# Altium schematic sheet УПП.SchDoc
size 420 x 297 mm; PageSetup: Record=PageOptions|CenterHorizontal=False|CenterVertical=False|PrintScale=0.95|XCorrection=0.00|YCorrection=0.00|PrintKind=1|BorderSize=5000000|LeftOffset=0|BottomOffset=0|Orientation=1|PaperLength=1000|PaperWidth=1000|Scale=100|PaperSource=15|PrintQuality=600|MediaType=1|DitherType=10|PaperKind=A4|PrintScaleMode=1; Scale: {Масш.}; Title1str: {Наименование}; Title2str: {Наименование}; ProcessInspection: {Т.контр.}; Mass: {Масса}; NormInspection: {Н.контр.}; EngineerName: {Инженер}; Letter1Column: {}; Letter2Column: {}; Letter3Column: {}; DocumentType: {Документ}; DocumentType1str: {Документ}; DocumentType2str: {Документ}; DocumentNumber1: {Обозначение 1}
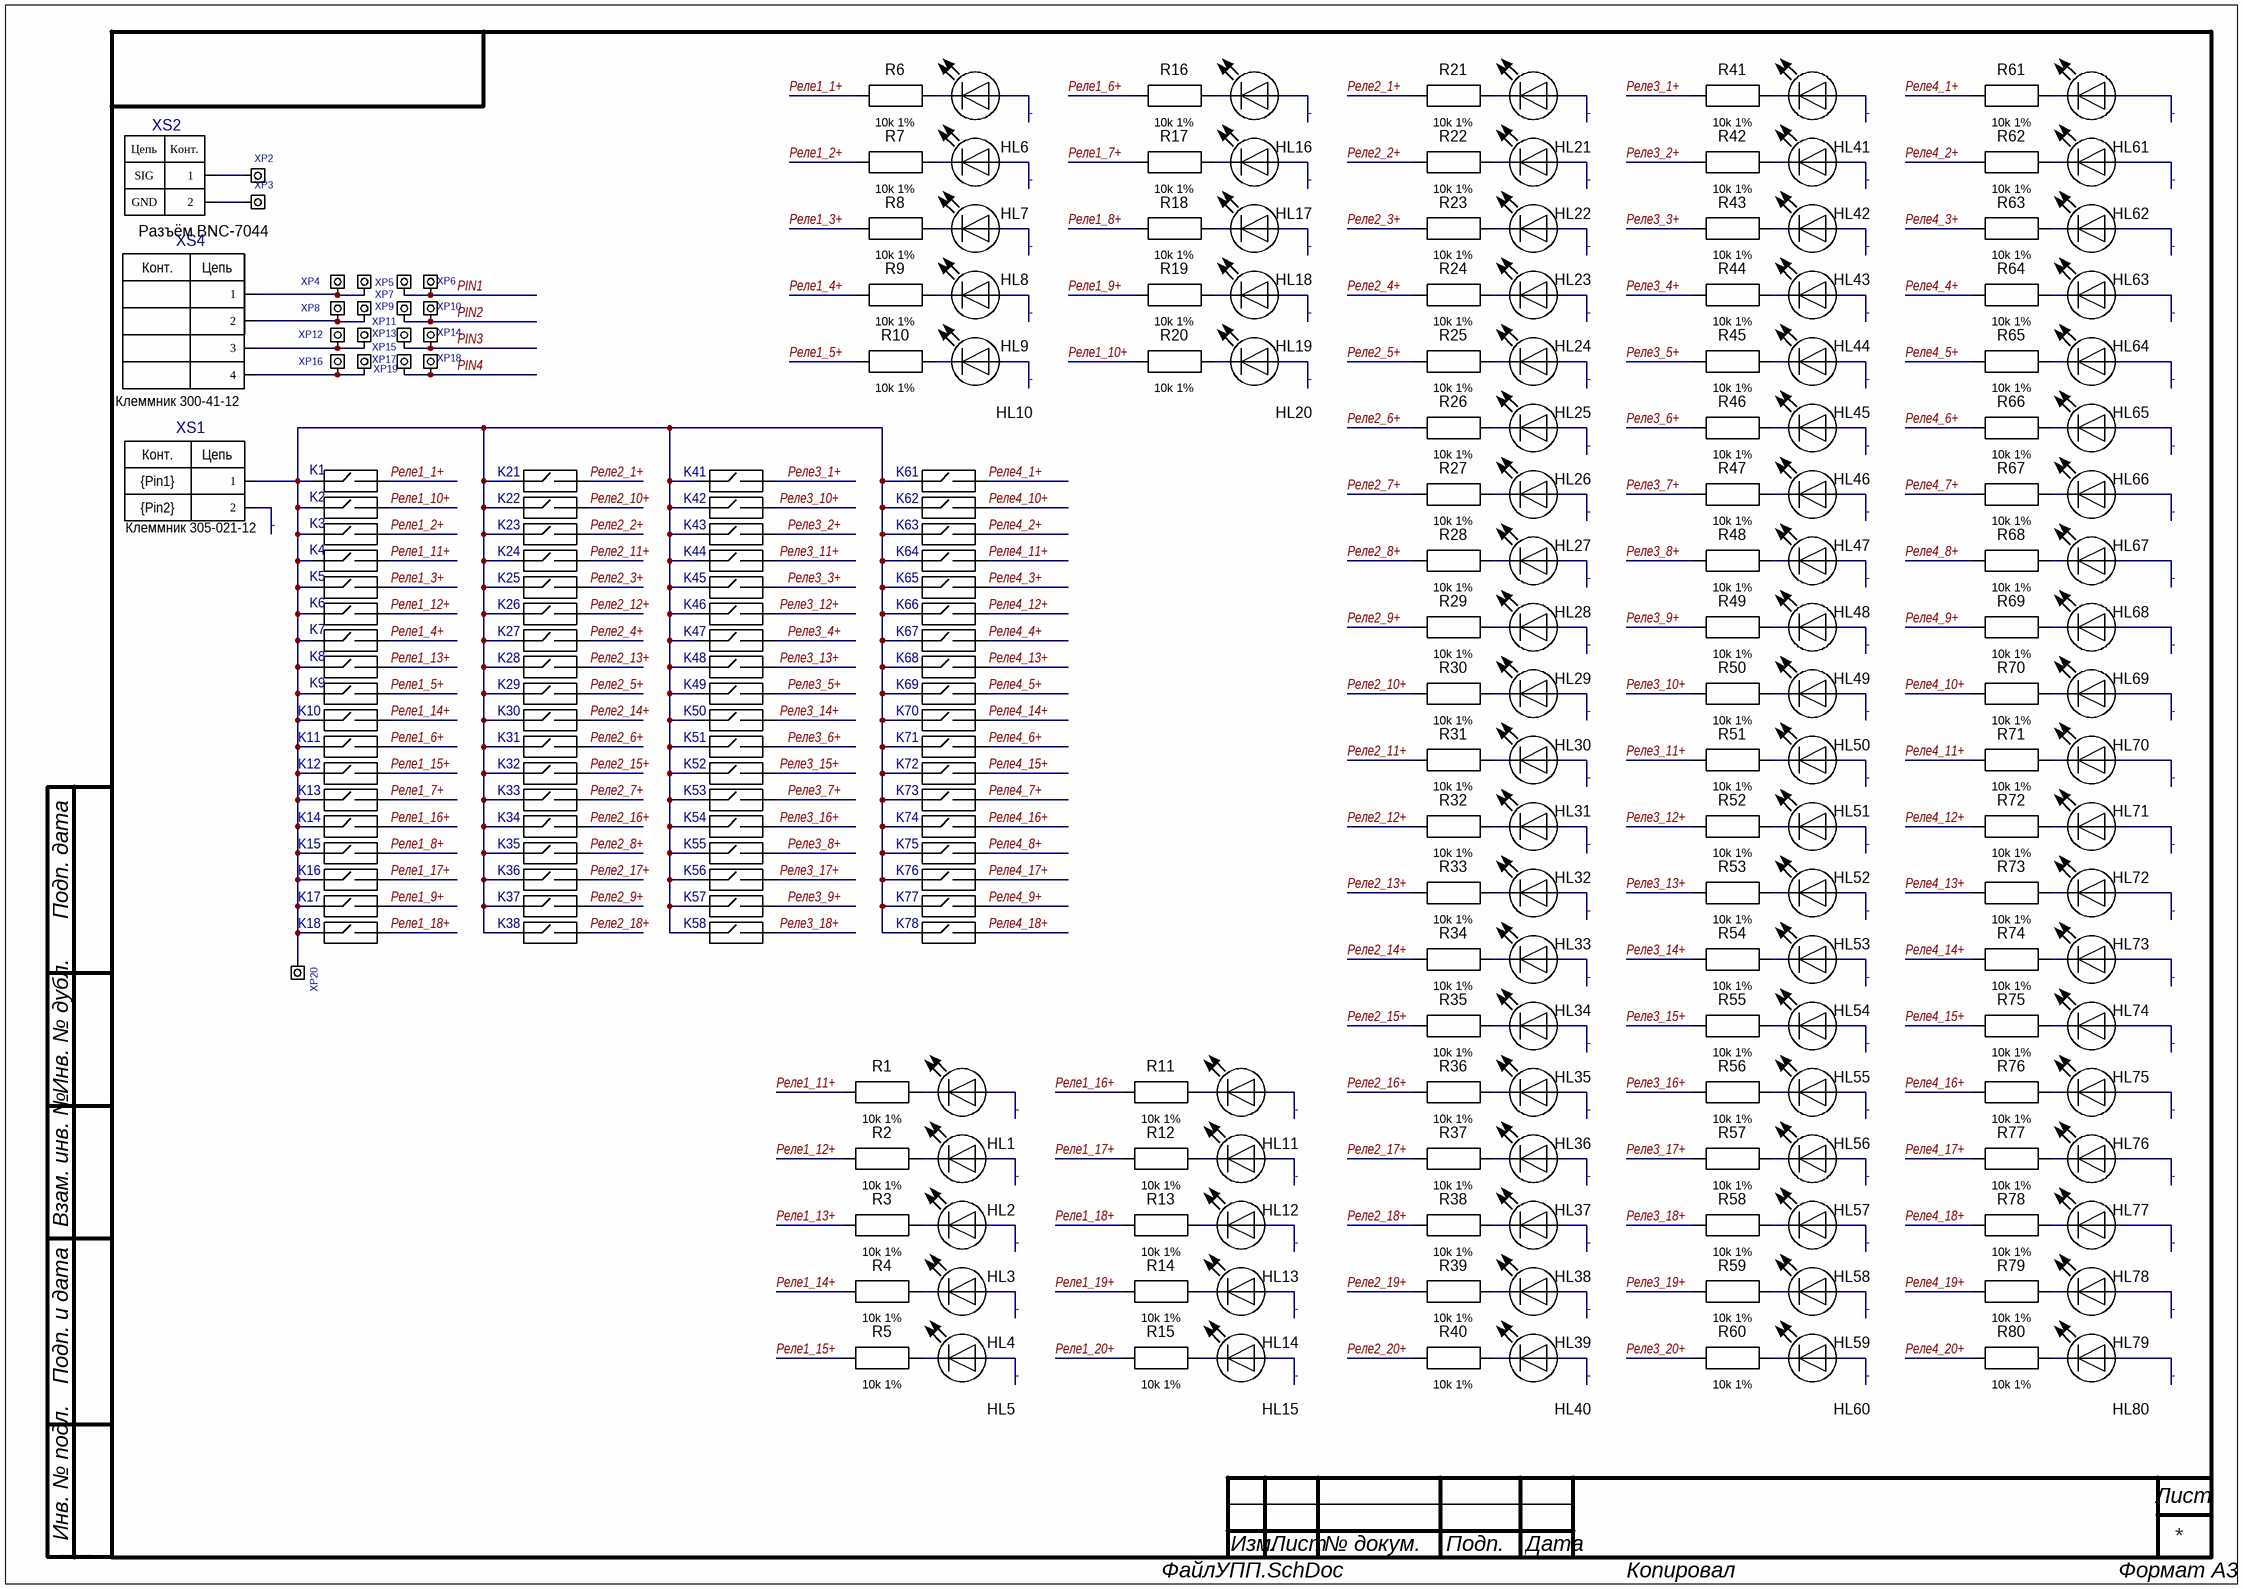
[diagram p0: УПП.SchDoc]

## Parts
HL1  Светодиод 2012 зеленый  [Kingbright KPT-2012G]  (value not drawn)
HL2  Светодиод 2012 зеленый  [Kingbright KPT-2012G]  (value not drawn)
HL3  Светодиод 2012 зеленый  [Kingbright KPT-2012G]  (value not drawn)
HL4  Светодиод 2012 зеленый  [Kingbright KPT-2012G]  (value not drawn)
HL5  Светодиод 2012 зеленый  [Kingbright KPT-2012G]  (value not drawn)
HL6  Светодиод 2012 зеленый  [Kingbright KPT-2012G]  (value not drawn)
HL7  Светодиод 2012 зеленый  [Kingbright KPT-2012G]  (value not drawn)
HL8  Светодиод 2012 зеленый  [Kingbright KPT-2012G]  (value not drawn)
HL9  Светодиод 2012 зеленый  [Kingbright KPT-2012G]  (value not drawn)
HL10  Светодиод 2012 зеленый  [Kingbright KPT-2012G]  (value not drawn)
HL11  Светодиод 2012 зеленый  [Kingbright KPT-2012G]  (value not drawn)
HL12  Светодиод 2012 зеленый  [Kingbright KPT-2012G]  (value not drawn)
HL13  Светодиод 2012 зеленый  [Kingbright KPT-2012G]  (value not drawn)
HL14  Светодиод 2012 зеленый  [Kingbright KPT-2012G]  (value not drawn)
HL15  Светодиод 2012 зеленый  [Kingbright KPT-2012G]  (value not drawn)
HL16  Светодиод 2012 зеленый  [Kingbright KPT-2012G]  (value not drawn)
HL17  Светодиод 2012 зеленый  [Kingbright KPT-2012G]  (value not drawn)
HL18  Светодиод 2012 зеленый  [Kingbright KPT-2012G]  (value not drawn)
HL19  Светодиод 2012 зеленый  [Kingbright KPT-2012G]  (value not drawn)
HL20  Светодиод 2012 зеленый  [Kingbright KPT-2012G]  (value not drawn)
HL21  Светодиод 2012 зеленый  [Kingbright KPT-2012G]  (value not drawn)
HL22  Светодиод 2012 зеленый  [Kingbright KPT-2012G]  (value not drawn)
HL23  Светодиод 2012 зеленый  [Kingbright KPT-2012G]  (value not drawn)
HL24  Светодиод 2012 зеленый  [Kingbright KPT-2012G]  (value not drawn)
HL25  Светодиод 2012 зеленый  [Kingbright KPT-2012G]  (value not drawn)
HL26  Светодиод 2012 зеленый  [Kingbright KPT-2012G]  (value not drawn)
HL27  Светодиод 2012 зеленый  [Kingbright KPT-2012G]  (value not drawn)
HL28  Светодиод 2012 зеленый  [Kingbright KPT-2012G]  (value not drawn)
HL29  Светодиод 2012 зеленый  [Kingbright KPT-2012G]  (value not drawn)
HL30  Светодиод 2012 зеленый  [Kingbright KPT-2012G]  (value not drawn)
HL31  Светодиод 2012 зеленый  [Kingbright KPT-2012G]  (value not drawn)
HL32  Светодиод 2012 зеленый  [Kingbright KPT-2012G]  (value not drawn)
HL33  Светодиод 2012 зеленый  [Kingbright KPT-2012G]  (value not drawn)
HL34  Светодиод 2012 зеленый  [Kingbright KPT-2012G]  (value not drawn)
HL35  Светодиод 2012 зеленый  [Kingbright KPT-2012G]  (value not drawn)
HL36  Светодиод 2012 зеленый  [Kingbright KPT-2012G]  (value not drawn)
HL37  Светодиод 2012 зеленый  [Kingbright KPT-2012G]  (value not drawn)
HL38  Светодиод 2012 зеленый  [Kingbright KPT-2012G]  (value not drawn)
HL39  Светодиод 2012 зеленый  [Kingbright KPT-2012G]  (value not drawn)
HL40  Светодиод 2012 зеленый  [Kingbright KPT-2012G]  (value not drawn)
HL41  Светодиод 2012 зеленый  [Kingbright KPT-2012G]  (value not drawn)
HL42  Светодиод 2012 зеленый  [Kingbright KPT-2012G]  (value not drawn)
HL43  Светодиод 2012 зеленый  [Kingbright KPT-2012G]  (value not drawn)
HL44  Светодиод 2012 зеленый  [Kingbright KPT-2012G]  (value not drawn)
HL45  Светодиод 2012 зеленый  [Kingbright KPT-2012G]  (value not drawn)
HL46  Светодиод 2012 зеленый  [Kingbright KPT-2012G]  (value not drawn)
HL47  Светодиод 2012 зеленый  [Kingbright KPT-2012G]  (value not drawn)
HL48  Светодиод 2012 зеленый  [Kingbright KPT-2012G]  (value not drawn)
HL49  Светодиод 2012 зеленый  [Kingbright KPT-2012G]  (value not drawn)
HL50  Светодиод 2012 зеленый  [Kingbright KPT-2012G]  (value not drawn)
HL51  Светодиод 2012 зеленый  [Kingbright KPT-2012G]  (value not drawn)
HL52  Светодиод 2012 зеленый  [Kingbright KPT-2012G]  (value not drawn)
HL53  Светодиод 2012 зеленый  [Kingbright KPT-2012G]  (value not drawn)
HL54  Светодиод 2012 зеленый  [Kingbright KPT-2012G]  (value not drawn)
HL55  Светодиод 2012 зеленый  [Kingbright KPT-2012G]  (value not drawn)
HL56  Светодиод 2012 зеленый  [Kingbright KPT-2012G]  (value not drawn)
HL57  Светодиод 2012 зеленый  [Kingbright KPT-2012G]  (value not drawn)
HL58  Светодиод 2012 зеленый  [Kingbright KPT-2012G]  (value not drawn)
HL59  Светодиод 2012 зеленый  [Kingbright KPT-2012G]  (value not drawn)
HL60  Светодиод 2012 зеленый  [Kingbright KPT-2012G]  (value not drawn)
HL61  Светодиод 2012 зеленый  [Kingbright KPT-2012G]  (value not drawn)
HL62  Светодиод 2012 зеленый  [Kingbright KPT-2012G]  (value not drawn)
HL63  Светодиод 2012 зеленый  [Kingbright KPT-2012G]  (value not drawn)
HL64  Светодиод 2012 зеленый  [Kingbright KPT-2012G]  (value not drawn)
HL65  Светодиод 2012 зеленый  [Kingbright KPT-2012G]  (value not drawn)
HL66  Светодиод 2012 зеленый  [Kingbright KPT-2012G]  (value not drawn)
HL67  Светодиод 2012 зеленый  [Kingbright KPT-2012G]  (value not drawn)
HL68  Светодиод 2012 зеленый  [Kingbright KPT-2012G]  (value not drawn)
HL69  Светодиод 2012 зеленый  [Kingbright KPT-2012G]  (value not drawn)
HL70  Светодиод 2012 зеленый  [Kingbright KPT-2012G]  (value not drawn)
HL71  Светодиод 2012 зеленый  [Kingbright KPT-2012G]  (value not drawn)
HL72  Светодиод 2012 зеленый  [Kingbright KPT-2012G]  (value not drawn)
HL73  Светодиод 2012 зеленый  [Kingbright KPT-2012G]  (value not drawn)
HL74  Светодиод 2012 зеленый  [Kingbright KPT-2012G]  (value not drawn)
HL75  Светодиод 2012 зеленый  [Kingbright KPT-2012G]  (value not drawn)
HL76  Светодиод 2012 зеленый  [Kingbright KPT-2012G]  (value not drawn)
HL77  Светодиод 2012 зеленый  [Kingbright KPT-2012G]  (value not drawn)
HL78  Светодиод 2012 зеленый  [Kingbright KPT-2012G]  (value not drawn)
HL79  Светодиод 2012 зеленый  [Kingbright KPT-2012G]  (value not drawn)
HL80  Светодиод 2012 зеленый  [Kingbright KPT-2012G]  (value not drawn)
K1  Микротумблер MTS-101 A-2  [MTS-101 A-2]  (value not drawn)
K2  Микротумблер MTS-101 A-2  [MTS-101 A-2]  (value not drawn)
K3  Микротумблер MTS-101 A-2  [MTS-101 A-2]  (value not drawn)
K4  Микротумблер MTS-101 A-2  [MTS-101 A-2]  (value not drawn)
K5  Микротумблер MTS-101 A-2  [MTS-101 A-2]  (value not drawn)
K6  Микротумблер MTS-101 A-2  [MTS-101 A-2]  (value not drawn)
K7  Микротумблер MTS-101 A-2  [MTS-101 A-2]  (value not drawn)
K8  Микротумблер MTS-101 A-2  [MTS-101 A-2]  (value not drawn)
K9  Микротумблер MTS-101 A-2  [MTS-101 A-2]  (value not drawn)
K10  Микротумблер MTS-101 A-2  [MTS-101 A-2]  (value not drawn)
K11  Микротумблер MTS-101 A-2  [MTS-101 A-2]  (value not drawn)
K12  Микротумблер MTS-101 A-2  [MTS-101 A-2]  (value not drawn)
K13  Микротумблер MTS-101 A-2  [MTS-101 A-2]  (value not drawn)
K14  Микротумблер MTS-101 A-2  [MTS-101 A-2]  (value not drawn)
K15  Микротумблер MTS-101 A-2  [MTS-101 A-2]  (value not drawn)
K16  Микротумблер MTS-101 A-2  [MTS-101 A-2]  (value not drawn)
K17  Микротумблер MTS-101 A-2  [MTS-101 A-2]  (value not drawn)
K18  Микротумблер MTS-101 A-2  [MTS-101 A-2]  (value not drawn)
K21  Микротумблер MTS-101 A-2  [MTS-101 A-2]  (value not drawn)
K22  Микротумблер MTS-101 A-2  [MTS-101 A-2]  (value not drawn)
K23  Микротумблер MTS-101 A-2  [MTS-101 A-2]  (value not drawn)
K24  Микротумблер MTS-101 A-2  [MTS-101 A-2]  (value not drawn)
K25  Микротумблер MTS-101 A-2  [MTS-101 A-2]  (value not drawn)
K26  Микротумблер MTS-101 A-2  [MTS-101 A-2]  (value not drawn)
K27  Микротумблер MTS-101 A-2  [MTS-101 A-2]  (value not drawn)
K28  Микротумблер MTS-101 A-2  [MTS-101 A-2]  (value not drawn)
K29  Микротумблер MTS-101 A-2  [MTS-101 A-2]  (value not drawn)
K30  Микротумблер MTS-101 A-2  [MTS-101 A-2]  (value not drawn)
K31  Микротумблер MTS-101 A-2  [MTS-101 A-2]  (value not drawn)
K32  Микротумблер MTS-101 A-2  [MTS-101 A-2]  (value not drawn)
K33  Микротумблер MTS-101 A-2  [MTS-101 A-2]  (value not drawn)
K34  Микротумблер MTS-101 A-2  [MTS-101 A-2]  (value not drawn)
K35  Микротумблер MTS-101 A-2  [MTS-101 A-2]  (value not drawn)
K36  Микротумблер MTS-101 A-2  [MTS-101 A-2]  (value not drawn)
K37  Микротумблер MTS-101 A-2  [MTS-101 A-2]  (value not drawn)
K38  Микротумблер MTS-101 A-2  [MTS-101 A-2]  (value not drawn)
K41  Микротумблер MTS-101 A-2  [MTS-101 A-2]  (value not drawn)
K42  Микротумблер MTS-101 A-2  [MTS-101 A-2]  (value not drawn)
K43  Микротумблер MTS-101 A-2  [MTS-101 A-2]  (value not drawn)
K44  Микротумблер MTS-101 A-2  [MTS-101 A-2]  (value not drawn)
K45  Микротумблер MTS-101 A-2  [MTS-101 A-2]  (value not drawn)
K46  Микротумблер MTS-101 A-2  [MTS-101 A-2]  (value not drawn)
K47  Микротумблер MTS-101 A-2  [MTS-101 A-2]  (value not drawn)
K48  Микротумблер MTS-101 A-2  [MTS-101 A-2]  (value not drawn)
K49  Микротумблер MTS-101 A-2  [MTS-101 A-2]  (value not drawn)
K50  Микротумблер MTS-101 A-2  [MTS-101 A-2]  (value not drawn)
K51  Микротумблер MTS-101 A-2  [MTS-101 A-2]  (value not drawn)
K52  Микротумблер MTS-101 A-2  [MTS-101 A-2]  (value not drawn)
K53  Микротумблер MTS-101 A-2  [MTS-101 A-2]  (value not drawn)
K54  Микротумблер MTS-101 A-2  [MTS-101 A-2]  (value not drawn)
K55  Микротумблер MTS-101 A-2  [MTS-101 A-2]  (value not drawn)
K56  Микротумблер MTS-101 A-2  [MTS-101 A-2]  (value not drawn)
K57  Микротумблер MTS-101 A-2  [MTS-101 A-2]  (value not drawn)
K58  Микротумблер MTS-101 A-2  [MTS-101 A-2]  (value not drawn)
K61  Микротумблер MTS-101 A-2  [MTS-101 A-2]  (value not drawn)
K62  Микротумблер MTS-101 A-2  [MTS-101 A-2]  (value not drawn)
K63  Микротумблер MTS-101 A-2  [MTS-101 A-2]  (value not drawn)
K64  Микротумблер MTS-101 A-2  [MTS-101 A-2]  (value not drawn)
K65  Микротумблер MTS-101 A-2  [MTS-101 A-2]  (value not drawn)
K66  Микротумблер MTS-101 A-2  [MTS-101 A-2]  (value not drawn)
K67  Микротумблер MTS-101 A-2  [MTS-101 A-2]  (value not drawn)
K68  Микротумблер MTS-101 A-2  [MTS-101 A-2]  (value not drawn)
K69  Микротумблер MTS-101 A-2  [MTS-101 A-2]  (value not drawn)
K70  Микротумблер MTS-101 A-2  [MTS-101 A-2]  (value not drawn)
K71  Микротумблер MTS-101 A-2  [MTS-101 A-2]  (value not drawn)
K72  Микротумблер MTS-101 A-2  [MTS-101 A-2]  (value not drawn)
K73  Микротумблер MTS-101 A-2  [MTS-101 A-2]  (value not drawn)
K74  Микротумблер MTS-101 A-2  [MTS-101 A-2]  (value not drawn)
K75  Микротумблер MTS-101 A-2  [MTS-101 A-2]  (value not drawn)
K76  Микротумблер MTS-101 A-2  [MTS-101 A-2]  (value not drawn)
K77  Микротумблер MTS-101 A-2  [MTS-101 A-2]  (value not drawn)
K78  Микротумблер MTS-101 A-2  [MTS-101 A-2]  (value not drawn)
R1  SchMark: 10k 1%  [0805_R]  (hidden comment: Резистор 0805 0,125 Вт 1% 10 кОм Yageo RC0805FR-0710KL)
R2  SchMark: 10k 1%  [0805_R]  (hidden comment: Резистор 0805 0,125 Вт 1% 10 кОм Yageo RC0805FR-0710KL)
R3  SchMark: 10k 1%  [0805_R]  (hidden comment: Резистор 0805 0,125 Вт 1% 10 кОм Yageo RC0805FR-0710KL)
R4  SchMark: 10k 1%  [0805_R]  (hidden comment: Резистор 0805 0,125 Вт 1% 10 кОм Yageo RC0805FR-0710KL)
R5  SchMark: 10k 1%  [0805_R]  (hidden comment: Резистор 0805 0,125 Вт 1% 10 кОм Yageo RC0805FR-0710KL)
R6  SchMark: 10k 1%  [0805_R]  (hidden comment: Резистор 0805 0,125 Вт 1% 10 кОм Yageo RC0805FR-0710KL)
R7  SchMark: 10k 1%  [0805_R]  (hidden comment: Резистор 0805 0,125 Вт 1% 10 кОм Yageo RC0805FR-0710KL)
R8  SchMark: 10k 1%  [0805_R]  (hidden comment: Резистор 0805 0,125 Вт 1% 10 кОм Yageo RC0805FR-0710KL)
R9  SchMark: 10k 1%  [0805_R]  (hidden comment: Резистор 0805 0,125 Вт 1% 10 кОм Yageo RC0805FR-0710KL)
R10  SchMark: 10k 1%  [0805_R]  (hidden comment: Резистор 0805 0,125 Вт 1% 10 кОм Yageo RC0805FR-0710KL)
R11  SchMark: 10k 1%  [0805_R]  (hidden comment: Резистор 0805 0,125 Вт 1% 10 кОм Yageo RC0805FR-0710KL)
R12  SchMark: 10k 1%  [0805_R]  (hidden comment: Резистор 0805 0,125 Вт 1% 10 кОм Yageo RC0805FR-0710KL)
R13  SchMark: 10k 1%  [0805_R]  (hidden comment: Резистор 0805 0,125 Вт 1% 10 кОм Yageo RC0805FR-0710KL)
R14  SchMark: 10k 1%  [0805_R]  (hidden comment: Резистор 0805 0,125 Вт 1% 10 кОм Yageo RC0805FR-0710KL)
R15  SchMark: 10k 1%  [0805_R]  (hidden comment: Резистор 0805 0,125 Вт 1% 10 кОм Yageo RC0805FR-0710KL)
R16  SchMark: 10k 1%  [0805_R]  (hidden comment: Резистор 0805 0,125 Вт 1% 10 кОм Yageo RC0805FR-0710KL)
R17  SchMark: 10k 1%  [0805_R]  (hidden comment: Резистор 0805 0,125 Вт 1% 10 кОм Yageo RC0805FR-0710KL)
R18  SchMark: 10k 1%  [0805_R]  (hidden comment: Резистор 0805 0,125 Вт 1% 10 кОм Yageo RC0805FR-0710KL)
R19  SchMark: 10k 1%  [0805_R]  (hidden comment: Резистор 0805 0,125 Вт 1% 10 кОм Yageo RC0805FR-0710KL)
R20  SchMark: 10k 1%  [0805_R]  (hidden comment: Резистор 0805 0,125 Вт 1% 10 кОм Yageo RC0805FR-0710KL)
R21  SchMark: 10k 1%  [0805_R]  (hidden comment: Резистор 0805 0,125 Вт 1% 10 кОм Yageo RC0805FR-0710KL)
R22  SchMark: 10k 1%  [0805_R]  (hidden comment: Резистор 0805 0,125 Вт 1% 10 кОм Yageo RC0805FR-0710KL)
R23  SchMark: 10k 1%  [0805_R]  (hidden comment: Резистор 0805 0,125 Вт 1% 10 кОм Yageo RC0805FR-0710KL)
R24  SchMark: 10k 1%  [0805_R]  (hidden comment: Резистор 0805 0,125 Вт 1% 10 кОм Yageo RC0805FR-0710KL)
R25  SchMark: 10k 1%  [0805_R]  (hidden comment: Резистор 0805 0,125 Вт 1% 10 кОм Yageo RC0805FR-0710KL)
R26  SchMark: 10k 1%  [0805_R]  (hidden comment: Резистор 0805 0,125 Вт 1% 10 кОм Yageo RC0805FR-0710KL)
R27  SchMark: 10k 1%  [0805_R]  (hidden comment: Резистор 0805 0,125 Вт 1% 10 кОм Yageo RC0805FR-0710KL)
R28  SchMark: 10k 1%  [0805_R]  (hidden comment: Резистор 0805 0,125 Вт 1% 10 кОм Yageo RC0805FR-0710KL)
R29  SchMark: 10k 1%  [0805_R]  (hidden comment: Резистор 0805 0,125 Вт 1% 10 кОм Yageo RC0805FR-0710KL)
R30  SchMark: 10k 1%  [0805_R]  (hidden comment: Резистор 0805 0,125 Вт 1% 10 кОм Yageo RC0805FR-0710KL)
R31  SchMark: 10k 1%  [0805_R]  (hidden comment: Резистор 0805 0,125 Вт 1% 10 кОм Yageo RC0805FR-0710KL)
R32  SchMark: 10k 1%  [0805_R]  (hidden comment: Резистор 0805 0,125 Вт 1% 10 кОм Yageo RC0805FR-0710KL)
R33  SchMark: 10k 1%  [0805_R]  (hidden comment: Резистор 0805 0,125 Вт 1% 10 кОм Yageo RC0805FR-0710KL)
R34  SchMark: 10k 1%  [0805_R]  (hidden comment: Резистор 0805 0,125 Вт 1% 10 кОм Yageo RC0805FR-0710KL)
R35  SchMark: 10k 1%  [0805_R]  (hidden comment: Резистор 0805 0,125 Вт 1% 10 кОм Yageo RC0805FR-0710KL)
R36  SchMark: 10k 1%  [0805_R]  (hidden comment: Резистор 0805 0,125 Вт 1% 10 кОм Yageo RC0805FR-0710KL)
R37  SchMark: 10k 1%  [0805_R]  (hidden comment: Резистор 0805 0,125 Вт 1% 10 кОм Yageo RC0805FR-0710KL)
R38  SchMark: 10k 1%  [0805_R]  (hidden comment: Резистор 0805 0,125 Вт 1% 10 кОм Yageo RC0805FR-0710KL)
R39  SchMark: 10k 1%  [0805_R]  (hidden comment: Резистор 0805 0,125 Вт 1% 10 кОм Yageo RC0805FR-0710KL)
R40  SchMark: 10k 1%  [0805_R]  (hidden comment: Резистор 0805 0,125 Вт 1% 10 кОм Yageo RC0805FR-0710KL)
R41  SchMark: 10k 1%  [0805_R]  (hidden comment: Резистор 0805 0,125 Вт 1% 10 кОм Yageo RC0805FR-0710KL)
R42  SchMark: 10k 1%  [0805_R]  (hidden comment: Резистор 0805 0,125 Вт 1% 10 кОм Yageo RC0805FR-0710KL)
R43  SchMark: 10k 1%  [0805_R]  (hidden comment: Резистор 0805 0,125 Вт 1% 10 кОм Yageo RC0805FR-0710KL)
R44  SchMark: 10k 1%  [0805_R]  (hidden comment: Резистор 0805 0,125 Вт 1% 10 кОм Yageo RC0805FR-0710KL)
R45  SchMark: 10k 1%  [0805_R]  (hidden comment: Резистор 0805 0,125 Вт 1% 10 кОм Yageo RC0805FR-0710KL)
R46  SchMark: 10k 1%  [0805_R]  (hidden comment: Резистор 0805 0,125 Вт 1% 10 кОм Yageo RC0805FR-0710KL)
R47  SchMark: 10k 1%  [0805_R]  (hidden comment: Резистор 0805 0,125 Вт 1% 10 кОм Yageo RC0805FR-0710KL)
R48  SchMark: 10k 1%  [0805_R]  (hidden comment: Резистор 0805 0,125 Вт 1% 10 кОм Yageo RC0805FR-0710KL)
R49  SchMark: 10k 1%  [0805_R]  (hidden comment: Резистор 0805 0,125 Вт 1% 10 кОм Yageo RC0805FR-0710KL)
R50  SchMark: 10k 1%  [0805_R]  (hidden comment: Резистор 0805 0,125 Вт 1% 10 кОм Yageo RC0805FR-0710KL)
R51  SchMark: 10k 1%  [0805_R]  (hidden comment: Резистор 0805 0,125 Вт 1% 10 кОм Yageo RC0805FR-0710KL)
R52  SchMark: 10k 1%  [0805_R]  (hidden comment: Резистор 0805 0,125 Вт 1% 10 кОм Yageo RC0805FR-0710KL)
R53  SchMark: 10k 1%  [0805_R]  (hidden comment: Резистор 0805 0,125 Вт 1% 10 кОм Yageo RC0805FR-0710KL)
R54  SchMark: 10k 1%  [0805_R]  (hidden comment: Резистор 0805 0,125 Вт 1% 10 кОм Yageo RC0805FR-0710KL)
R55  SchMark: 10k 1%  [0805_R]  (hidden comment: Резистор 0805 0,125 Вт 1% 10 кОм Yageo RC0805FR-0710KL)
R56  SchMark: 10k 1%  [0805_R]  (hidden comment: Резистор 0805 0,125 Вт 1% 10 кОм Yageo RC0805FR-0710KL)
R57  SchMark: 10k 1%  [0805_R]  (hidden comment: Резистор 0805 0,125 Вт 1% 10 кОм Yageo RC0805FR-0710KL)
R58  SchMark: 10k 1%  [0805_R]  (hidden comment: Резистор 0805 0,125 Вт 1% 10 кОм Yageo RC0805FR-0710KL)
R59  SchMark: 10k 1%  [0805_R]  (hidden comment: Резистор 0805 0,125 Вт 1% 10 кОм Yageo RC0805FR-0710KL)
R60  SchMark: 10k 1%  [0805_R]  (hidden comment: Резистор 0805 0,125 Вт 1% 10 кОм Yageo RC0805FR-0710KL)
R61  SchMark: 10k 1%  [0805_R]  (hidden comment: Резистор 0805 0,125 Вт 1% 10 кОм Yageo RC0805FR-0710KL)
R62  SchMark: 10k 1%  [0805_R]  (hidden comment: Резистор 0805 0,125 Вт 1% 10 кОм Yageo RC0805FR-0710KL)
R63  SchMark: 10k 1%  [0805_R]  (hidden comment: Резистор 0805 0,125 Вт 1% 10 кОм Yageo RC0805FR-0710KL)
R64  SchMark: 10k 1%  [0805_R]  (hidden comment: Резистор 0805 0,125 Вт 1% 10 кОм Yageo RC0805FR-0710KL)
R65  SchMark: 10k 1%  [0805_R]  (hidden comment: Резистор 0805 0,125 Вт 1% 10 кОм Yageo RC0805FR-0710KL)
R66  SchMark: 10k 1%  [0805_R]  (hidden comment: Резистор 0805 0,125 Вт 1% 10 кОм Yageo RC0805FR-0710KL)
R67  SchMark: 10k 1%  [0805_R]  (hidden comment: Резистор 0805 0,125 Вт 1% 10 кОм Yageo RC0805FR-0710KL)
R68  SchMark: 10k 1%  [0805_R]  (hidden comment: Резистор 0805 0,125 Вт 1% 10 кОм Yageo RC0805FR-0710KL)
R69  SchMark: 10k 1%  [0805_R]  (hidden comment: Резистор 0805 0,125 Вт 1% 10 кОм Yageo RC0805FR-0710KL)
R70  SchMark: 10k 1%  [0805_R]  (hidden comment: Резистор 0805 0,125 Вт 1% 10 кОм Yageo RC0805FR-0710KL)
R71  SchMark: 10k 1%  [0805_R]  (hidden comment: Резистор 0805 0,125 Вт 1% 10 кОм Yageo RC0805FR-0710KL)
R72  SchMark: 10k 1%  [0805_R]  (hidden comment: Резистор 0805 0,125 Вт 1% 10 кОм Yageo RC0805FR-0710KL)
R73  SchMark: 10k 1%  [0805_R]  (hidden comment: Резистор 0805 0,125 Вт 1% 10 кОм Yageo RC0805FR-0710KL)
R74  SchMark: 10k 1%  [0805_R]  (hidden comment: Резистор 0805 0,125 Вт 1% 10 кОм Yageo RC0805FR-0710KL)
R75  SchMark: 10k 1%  [0805_R]  (hidden comment: Резистор 0805 0,125 Вт 1% 10 кОм Yageo RC0805FR-0710KL)
R76  SchMark: 10k 1%  [0805_R]  (hidden comment: Резистор 0805 0,125 Вт 1% 10 кОм Yageo RC0805FR-0710KL)
R77  SchMark: 10k 1%  [0805_R]  (hidden comment: Резистор 0805 0,125 Вт 1% 10 кОм Yageo RC0805FR-0710KL)
R78  SchMark: 10k 1%  [0805_R]  (hidden comment: Резистор 0805 0,125 Вт 1% 10 кОм Yageo RC0805FR-0710KL)
R79  SchMark: 10k 1%  [0805_R]  (hidden comment: Резистор 0805 0,125 Вт 1% 10 кОм Yageo RC0805FR-0710KL)
R80  SchMark: 10k 1%  [0805_R]  (hidden comment: Резистор 0805 0,125 Вт 1% 10 кОм Yageo RC0805FR-0710KL)
XP2  Разъём PLS-1  [PLS-1]  (value not drawn)
XP3  Разъём PLS-1  [PLS-1]  (value not drawn)
XP4  Разъём PLS-1  [PLS-1]  (value not drawn)
XP5  Разъём PLS-1  [PLS-1]  (value not drawn)
XP6  Разъём PLS-1  [PLS-1]  (value not drawn)
XP7  Разъём PLS-1  [PLS-1]  (value not drawn)
XP8  Разъём PLS-1  [PLS-1]  (value not drawn)
XP9  Разъём PLS-1  [PLS-1]  (value not drawn)
XP10  Разъём PLS-1  [PLS-1]  (value not drawn)
XP11  Разъём PLS-1  [PLS-1]  (value not drawn)
XP12  Разъём PLS-1  [PLS-1]  (value not drawn)
XP13  Разъём PLS-1  [PLS-1]  (value not drawn)
XP14  Разъём PLS-1  [PLS-1]  (value not drawn)
XP15  Разъём PLS-1  [PLS-1]  (value not drawn)
XP16  Разъём PLS-1  [PLS-1]  (value not drawn)
XP17  Разъём PLS-1  [PLS-1]  (value not drawn)
XP18  Разъём PLS-1  [PLS-1]  (value not drawn)
XP19  Разъём PLS-1  [PLS-1]  (value not drawn)
XP20  Разъём PLS-1  [PLS-1]  (value not drawn)
XS1  Клеммник 305-021-12  Pin2: {Pin2}  Pin1: {Pin1}  [305-021-12]
XS2  Разъём BNC-7044  [BNC-7044]
XS4  Клеммник 300-41-12  [300-041-12]

## Nets
GND: XS2.3 XS2.4
-: HL1.1(A) HL2.1(A) HL3.1(A) HL4.1(A) HL5.1(A) HL6.1(A) HL7.1(A) HL8.1(A) HL9.1(A) HL10.1(A) HL11.1(A) HL12.1(A) HL13.1(A) HL14.1(A) HL15.1(A) HL16.1(A) HL17.1(A) HL18.1(A) HL19.1(A) HL20.1(A) HL21.1(A) HL22.1(A) HL23.1(A) HL24.1(A) HL25.1(A) HL26.1(A) HL27.1(A) HL28.1(A) HL29.1(A) HL30.1(A) HL31.1(A) HL32.1(A) HL33.1(A) HL34.1(A) HL35.1(A) HL36.1(A) HL37.1(A) HL38.1(A) HL39.1(A) HL40.1(A) HL41.1(A) HL42.1(A) HL43.1(A) HL44.1(A) HL45.1(A) HL46.1(A) HL47.1(A) HL48.1(A) HL49.1(A) HL50.1(A) HL51.1(A) HL52.1(A) HL53.1(A) HL54.1(A) HL55.1(A) HL56.1(A) HL57.1(A) HL58.1(A) HL59.1(A) HL60.1(A) HL61.1(A) HL62.1(A) HL63.1(A) HL64.1(A) HL65.1(A) HL66.1(A) HL67.1(A) HL68.1(A) HL69.1(A) HL70.1(A) HL71.1(A) HL72.1(A) HL73.1(A) HL74.1(A) HL75.1(A) HL76.1(A) HL77.1(A) HL78.1(A) HL79.1(A) HL80.1(A) XS1.2
PIN1: XP5.1 XP6.1
PIN2: XP9.1 XP10.1
PIN3: XP14.1 XP15.1
PIN4: XP17.1 XP18.1
Реле1_1+: K1.2 R6.2
Реле1_2+: K3.2 R7.2
Реле1_3+: K5.2 R8.2
Реле1_4+: K7.2 R9.2
Реле1_5+: K9.2 R10.2
Реле1_6+: K11.2 R16.2
Реле1_7+: K13.2 R17.2
Реле1_8+: K15.2 R18.2
Реле1_9+: K17.2 R19.2
Реле1_10+: K2.2 R20.2
Реле1_11+: K4.2 R1.2
Реле1_12+: K6.2 R2.2
Реле1_13+: K8.2 R3.2
Реле1_14+: K10.2 R4.2
Реле1_15+: K12.2 R5.2
Реле1_16+: K14.2 R11.2
Реле1_17+: K16.2 R12.2
Реле1_18+: K18.2 R13.2
Реле1_19+: R14.2
Реле1_20+: R15.2
Реле2_1+: K21.2 R21.2
Реле2_2+: K23.2 R22.2
Реле2_3+: K25.2 R23.2
Реле2_4+: K27.2 R24.2
Реле2_5+: K29.2 R25.2
Реле2_6+: K31.2 R26.2
Реле2_7+: K33.2 R27.2
Реле2_8+: K35.2 R28.2
Реле2_9+: K37.2 R29.2
Реле2_10+: K22.2 R30.2
Реле2_11+: K24.2 R31.2
Реле2_12+: K26.2 R32.2
Реле2_13+: K28.2 R33.2
Реле2_14+: K30.2 R34.2
Реле2_15+: K32.2 R35.2
Реле2_16+: K34.2 R36.2
Реле2_17+: K36.2 R37.2
Реле2_18+: K38.2 R38.2
Реле2_19+: R39.2
Реле2_20+: R40.2
Реле3_1+: K41.2 R41.2
Реле3_2+: K43.2 R42.2
Реле3_3+: K45.2 R43.2
Реле3_4+: K47.2 R44.2
Реле3_5+: K49.2 R45.2
Реле3_6+: K51.2 R46.2
Реле3_7+: K53.2 R47.2
Реле3_8+: K55.2 R48.2
Реле3_9+: K57.2 R49.2
Реле3_10+: K42.2 R50.2
Реле3_11+: K44.2 R51.2
Реле3_12+: K46.2 R52.2
Реле3_13+: K48.2 R53.2
Реле3_14+: K50.2 R54.2
Реле3_15+: K52.2 R55.2
Реле3_16+: K54.2 R56.2
Реле3_17+: K56.2 R57.2
Реле3_18+: K58.2 R58.2
Реле3_19+: R59.2
Реле3_20+: R60.2
Реле4_1+: K61.2 R61.2
Реле4_2+: K63.2 R62.2
Реле4_3+: K65.2 R63.2
Реле4_4+: K67.2 R64.2
Реле4_5+: K69.2 R65.2
Реле4_6+: K71.2 R66.2
Реле4_7+: K73.2 R67.2
Реле4_8+: K75.2 R68.2
Реле4_9+: K77.2 R69.2
Реле4_10+: K62.2 R70.2
Реле4_11+: K64.2 R71.2
Реле4_12+: K66.2 R72.2
Реле4_13+: K68.2 R73.2
Реле4_14+: K70.2 R74.2
Реле4_15+: K72.2 R75.2
Реле4_16+: K74.2 R76.2
Реле4_17+: K76.2 R77.2
Реле4_18+: K78.2 R78.2
Реле4_19+: R79.2
Реле4_20+: R80.2
NetHL1_2: HL1.2(K) R1.1
NetHL2_2: HL2.2(K) R2.1
NetHL3_2: HL3.2(K) R3.1
NetHL4_2: HL4.2(K) R4.1
NetHL5_2: HL5.2(K) R5.1
NetHL6_2: HL6.2(K) R6.1
NetHL7_2: HL7.2(K) R7.1
NetHL8_2: HL8.2(K) R8.1
NetHL9_2: HL9.2(K) R9.1
NetHL10_2: HL10.2(K) R10.1
NetHL11_2: HL11.2(K) R11.1
NetHL12_2: HL12.2(K) R12.1
NetHL13_2: HL13.2(K) R13.1
NetHL14_2: HL14.2(K) R14.1
NetHL15_2: HL15.2(K) R15.1
NetHL16_2: HL16.2(K) R16.1
NetHL17_2: HL17.2(K) R17.1
NetHL18_2: HL18.2(K) R18.1
NetHL19_2: HL19.2(K) R19.1
NetHL20_2: HL20.2(K) R20.1
NetHL21_2: HL21.2(K) R21.1
NetHL22_2: HL22.2(K) R22.1
NetHL23_2: HL23.2(K) R23.1
NetHL24_2: HL24.2(K) R24.1
NetHL25_2: HL25.2(K) R25.1
NetHL26_2: HL26.2(K) R26.1
NetHL27_2: HL27.2(K) R27.1
NetHL28_2: HL28.2(K) R28.1
NetHL29_2: HL29.2(K) R29.1
NetHL30_2: HL30.2(K) R30.1
NetHL31_2: HL31.2(K) R31.1
NetHL32_2: HL32.2(K) R32.1
NetHL33_2: HL33.2(K) R33.1
NetHL34_2: HL34.2(K) R34.1
NetHL35_2: HL35.2(K) R35.1
NetHL36_2: HL36.2(K) R36.1
NetHL37_2: HL37.2(K) R37.1
NetHL38_2: HL38.2(K) R38.1
NetHL39_2: HL39.2(K) R39.1
NetHL40_2: HL40.2(K) R40.1
NetHL41_2: HL41.2(K) R41.1
NetHL42_2: HL42.2(K) R42.1
NetHL43_2: HL43.2(K) R43.1
NetHL44_2: HL44.2(K) R44.1
NetHL45_2: HL45.2(K) R45.1
NetHL46_2: HL46.2(K) R46.1
NetHL47_2: HL47.2(K) R47.1
NetHL48_2: HL48.2(K) R48.1
NetHL49_2: HL49.2(K) R49.1
NetHL50_2: HL50.2(K) R50.1
NetHL51_2: HL51.2(K) R51.1
NetHL52_2: HL52.2(K) R52.1
NetHL53_2: HL53.2(K) R53.1
NetHL54_2: HL54.2(K) R54.1
NetHL55_2: HL55.2(K) R55.1
NetHL56_2: HL56.2(K) R56.1
NetHL57_2: HL57.2(K) R57.1
NetHL58_2: HL58.2(K) R58.1
NetHL59_2: HL59.2(K) R59.1
NetHL60_2: HL60.2(K) R60.1
NetHL61_2: HL61.2(K) R61.1
NetHL62_2: HL62.2(K) R62.1
NetHL63_2: HL63.2(K) R63.1
NetHL64_2: HL64.2(K) R64.1
NetHL65_2: HL65.2(K) R65.1
NetHL66_2: HL66.2(K) R66.1
NetHL67_2: HL67.2(K) R67.1
NetHL68_2: HL68.2(K) R68.1
NetHL69_2: HL69.2(K) R69.1
NetHL70_2: HL70.2(K) R70.1
NetHL71_2: HL71.2(K) R71.1
NetHL72_2: HL72.2(K) R72.1
NetHL73_2: HL73.2(K) R73.1
NetHL74_2: HL74.2(K) R74.1
NetHL75_2: HL75.2(K) R75.1
NetHL76_2: HL76.2(K) R76.1
NetHL77_2: HL77.2(K) R77.1
NetHL78_2: HL78.2(K) R78.1
NetHL79_2: HL79.2(K) R79.1
NetHL80_2: HL80.2(K) R80.1
NetK1_1: K1.1 K2.1 K3.1 K4.1 K5.1 K6.1 K7.1 K8.1 K9.1 K10.1 K11.1 K12.1 K13.1 K14.1 K15.1 K16.1 K17.1 K18.1 K21.1 K22.1 K23.1 K24.1 K25.1 K26.1 K27.1 K28.1 K29.1 K30.1 K31.1 K32.1 K33.1 K34.1 K35.1 K36.1 K37.1 K38.1 K41.1 K42.1 K43.1 K44.1 K45.1 K46.1 K47.1 K48.1 K49.1 K50.1 K51.1 K52.1 K53.1 K54.1 K55.1 K56.1 K57.1 K58.1 K61.1 K62.1 K63.1 K64.1 K65.1 K66.1 K67.1 K68.1 K69.1 K70.1 K71.1 K72.1 K73.1 K74.1 K75.1 K76.1 K77.1 K78.1 XP20.1 XS1.1
NetXP2_1: XP2.1 XS2.1
NetXP3_1: XP3.1 XS2.2
NetXP4_1: XP4.1 XP7.1 XS4.1
NetXP8_1: XP8.1 XP11.1 XS4.2
NetXP12_1: XP12.1 XP13.1 XS4.3
NetXP16_1: XP16.1 XP19.1 XS4.4

## Notes on the sheet
- Подп. дата
- Инв. № дубл.
- Взам. инв. №
- Подп. и дата
- Инв. № подл.
- Изм.
- Лист
- № докум.
- Подп.
- Дата
- ALTIUM GOSTBOM2.0 KEV
- Файл:
- Копировал
- Формат А3
- (in symbol 305-021-12) Конт.; Цепь
- (in symbol BNC-7044) Цепь; Конт.; SIG; GND

## Library data of the parts
HL1-HL80 = KPT-2012CGCK: Светодиод; Manufacturer: Kingbright; Id: 1053; Description1: 2012; Name1c: ***; UserPrice: 0; UserAmount: 1; Part Number: KPT-2012CGCK; Description2: зеленый; HelpURL: L:\Datasheet\Led\KPT-2012CGCK(Ver.24B).pdf; SymbolName: HL; SchMark: KPT-2012CGCK
K1-K18 K21-K38 K41-K58 K61-K78 = Микротумблер: Value: *
R1-R80 = RC0805FR-0710KL: Резистор; Description2: 10 кОм; Id: 246; Name1c: Резистор RC0805FR-0710KL (10 кОм ±1%); Value: 10k; Part Number: RC0805FR-0710KL; Description1: 0805 0,125 Вт 1%; SymbolName: R; Manufacturer: Yageo; Package: 0805
XP2-XP20 = PLS-1: Разъём; Value: *
XS1 XS4 = 305-021-12: Value: *
XS2 = BNC-7044